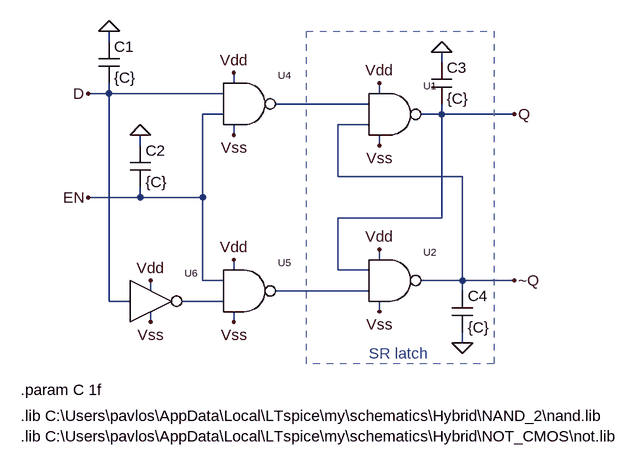
[diagram p0: schematic D.asc]
D.asc, the LTspice schematic file:
Version 4
SHEET 1 880 680
WIRE -592 -320 -592 -336
WIRE -80 -288 -80 -304
WIRE -400 -256 -400 -272
WIRE -592 -240 -592 -256
WIRE -592 -240 -624 -240
WIRE -416 -240 -592 -240
WIRE -176 -240 -176 -256
WIRE -192 -224 -336 -224
WIRE -416 -208 -448 -208
WIRE -80 -208 -80 -224
WIRE -80 -208 -112 -208
WIRE 32 -208 -80 -208
WIRE -192 -192 -240 -192
WIRE -400 -176 -400 -192
WIRE -544 -160 -544 -176
WIRE -176 -160 -176 -176
WIRE -240 -112 -240 -192
WIRE -48 -112 -240 -112
WIRE -544 -80 -544 -96
WIRE -544 -80 -624 -80
WIRE -448 -80 -448 -208
WIRE -448 -80 -544 -80
WIRE -80 -48 -80 -208
WIRE -80 -48 -240 -48
WIRE -176 16 -176 0
WIRE -400 32 -400 16
WIRE -240 32 -240 -48
WIRE -192 32 -240 32
WIRE -448 48 -448 -80
WIRE -416 48 -448 48
WIRE -48 48 -48 -112
WIRE -48 48 -112 48
WIRE 32 48 -48 48
WIRE -528 64 -528 48
WIRE -192 64 -336 64
WIRE -48 64 -48 48
WIRE -592 80 -592 -240
WIRE -560 80 -592 80
WIRE -416 80 -480 80
WIRE -176 96 -176 80
WIRE -528 112 -528 96
WIRE -400 112 -400 96
WIRE -48 144 -48 128
FLAG -176 -256 Vdd
FLAG -176 0 Vdd
FLAG -176 -160 Vss
FLAG -176 96 Vss
FLAG -624 -240 D
FLAG -624 -80 EN
FLAG 32 -208 Q
FLAG 32 48 ~Q
FLAG -400 -272 Vdd
FLAG -400 -176 Vss
FLAG -400 16 Vdd
FLAG -400 112 Vss
FLAG -528 48 Vdd
FLAG -528 112 Vss
FLAG -544 -176 0
FLAG -592 -336 0
FLAG -80 -304 0
FLAG -48 144 0
SYMBOL nand -192 -176 R0
SYMATTR InstName U1
SYMBOL nand -192 80 R0
SYMATTR InstName U2
SYMBOL nand -416 -192 R0
SYMATTR InstName U4
SYMBOL nand -416 96 R0
SYMATTR InstName U5
SYMBOL not -560 112 R0
SYMATTR InstName U6
SYMBOL cap -608 -320 R0
SYMATTR InstName C1
SYMATTR Value {C}
SYMBOL cap -560 -160 R0
SYMATTR InstName C2
SYMATTR Value {C}
SYMBOL cap -96 -288 R0
SYMATTR InstName C3
SYMATTR Value {C}
SYMBOL cap -64 64 R0
SYMATTR InstName C4
SYMATTR Value {C}
TEXT -728 256 Left 2 !.lib C:\\Users\\pavlos\\AppData\\Local\\LTspice\\my\\schematics\\Hybrid\\NAND_2\\nand.lib
TEXT -192 160 Left 2 ;SR latch
TEXT -728 288 Left 2 !.lib C:\\Users\\pavlos\\AppData\\Local\\LTspice\\my\\schematics\\Hybrid\\NOT_CMOS\\not.lib
TEXT -728 216 Left 2 !.param C 1f
RECTANGLE Normal 0 176 -288 -336 2

The netlist it stands for:
* D.asc
XU1 N001 ~Q Q Vdd Vss nand  ; pins A B Y Vdd Vss
XU2 Q N002 ~Q Vdd Vss nand  ; pins A B Y Vdd Vss
XU4 D EN N001 Vdd Vss nand  ; pins A B Y Vdd Vss
XU5 EN N003 N002 Vdd Vss nand  ; pins A B Y Vdd Vss
XU6 D N003 Vdd Vss not  ; pins A Y Vdd Vss
C1 0 D {C}
C2 0 EN {C}
C3 0 Q {C}
C4 ~Q 0 {C}
.lib C:\Users\pavlos\AppData\Local\LTspice\my\schematics\Hybrid\NAND_2\nand.lib
* SR latch
.lib C:\Users\pavlos\AppData\Local\LTspice\my\schematics\Hybrid\NOT_CMOS\not.lib
.param C 1f
.backanno
.end